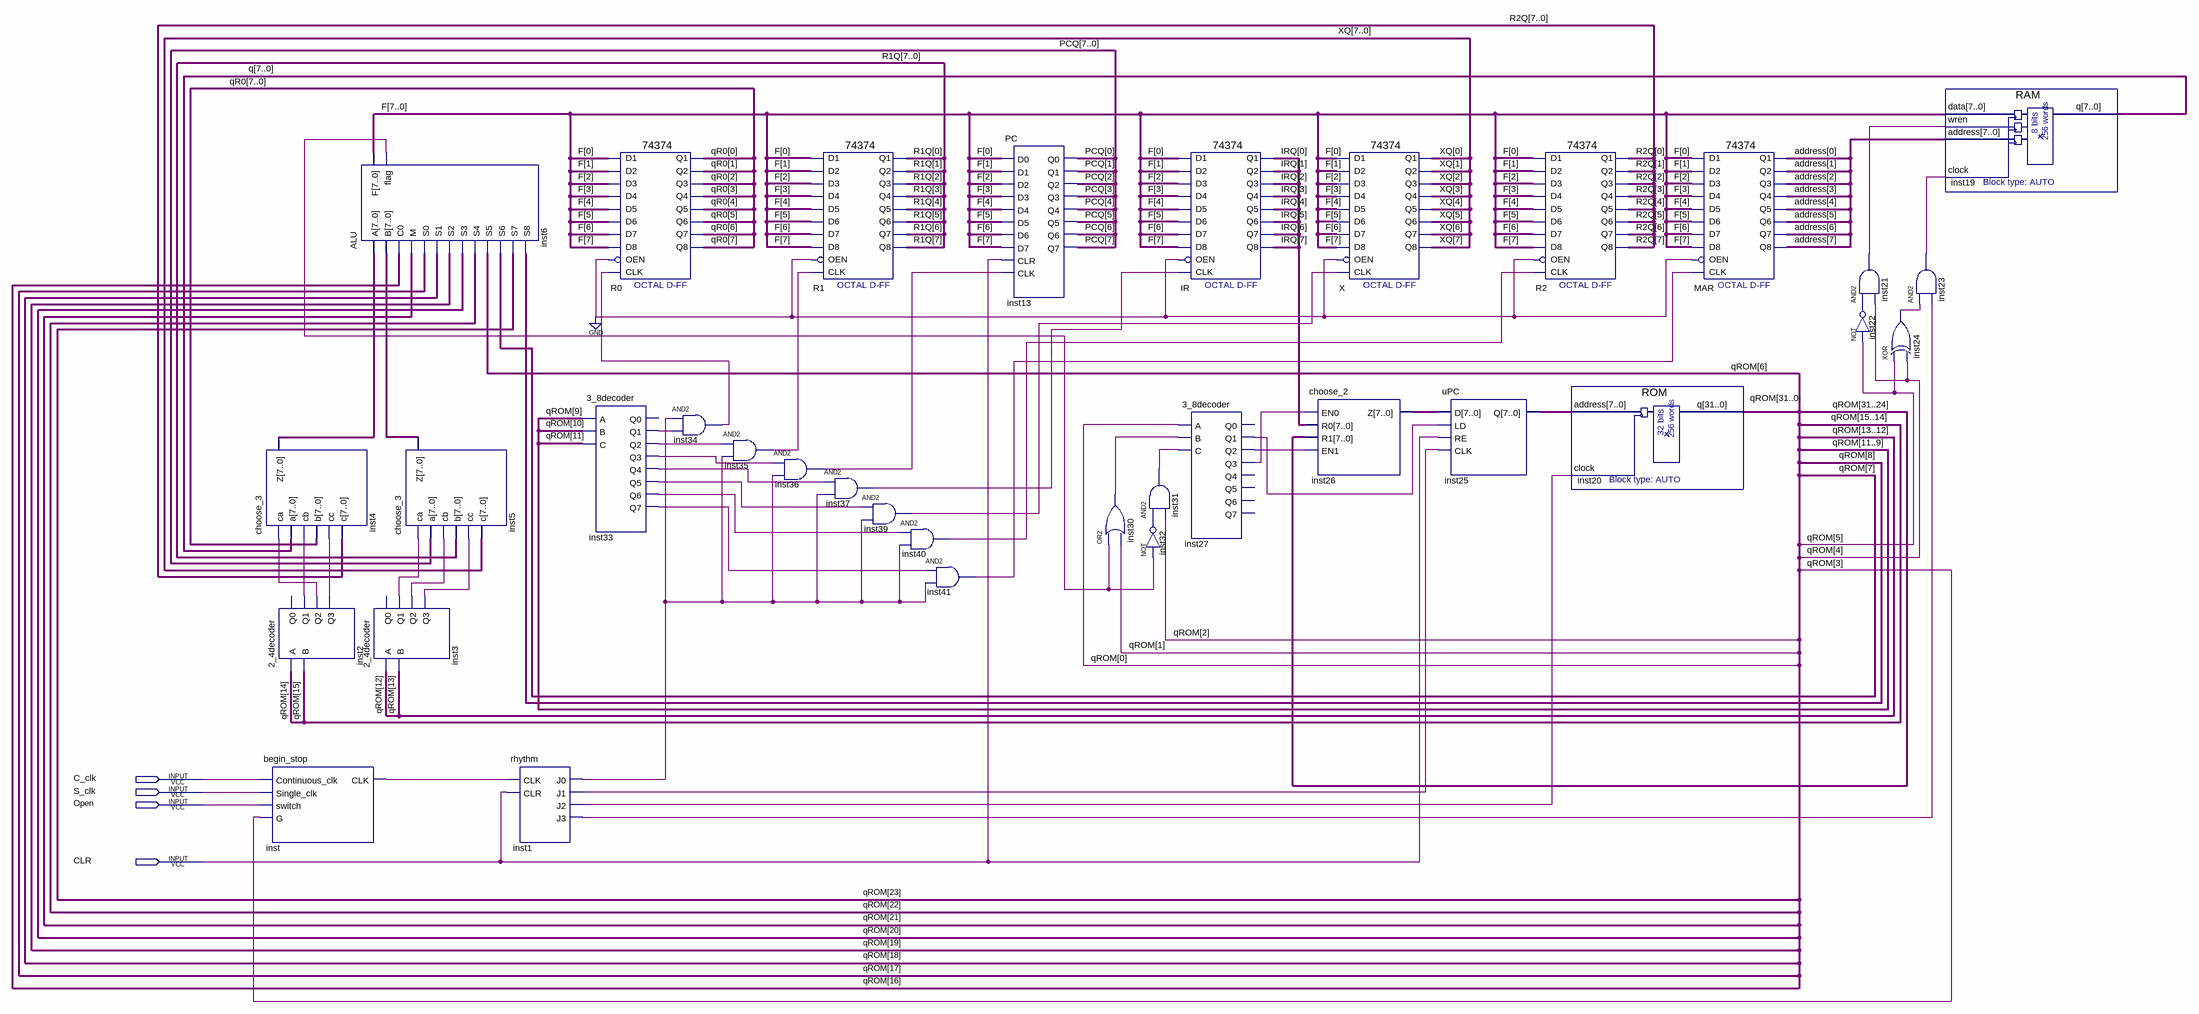
[diagram p0: schematic sheet]
// Quartus schematic ex3test.bdf as structural Verilog: 34 symbols, 4 pins
module ex3test (
  input  C_clk,
  input  S_clk,
  input  Open,
  input  CLR
);

  wire inst1_j0, inst1_j1, inst1_j2, inst1_j3, inst2_q1, inst2_q2, inst2_q3, inst3_q1, inst3_q2, inst3_q3,
       inst6_flag, inst21_out, inst22_out, inst23_out, inst24_out, inst27_q1, inst27_q2, inst27_q3,
       inst30_out, inst31_out, inst32_out, inst33_q1, inst33_q2, inst33_q3, inst33_q4, inst33_q5, inst33_q6,
       inst33_q7, inst34_out, inst35_out, inst36_out, inst37_out, inst39_out, inst40_out, inst41_out,
       inst_clk;
  wire [7:0] address, F, inst4_z, inst5_z, inst25_q, inst26_z, IRQ, PCQ, q, qR0, R1Q, R2Q, XQ;
  wire [31:0] qROM;

  choose_3 inst4 (.ca(inst2_q2), .a(q), .cb(inst2_q1), .b(qR0), .cc(inst2_q3), .c(R2Q), .Z(inst4_z));
  \2_4decoder  inst2 (.A(qROM[14]), .B(qROM[15]), .Q1(inst2_q1), .Q2(inst2_q2), .Q3(inst2_q3));  // open: Q0
  begin_stop inst (.Continuous_clk(C_clk), .Single_clk(S_clk), .switch(Open), .G(qROM[3]), .CLK(inst_clk));
  ALU inst6 (
    .A(inst4_z), .B(inst5_z), .C0(qROM[16]), .M(qROM[21]), .S0(qROM[17]), .S1(qROM[18]), .S2(qROM[19]),
    .S3(qROM[20]), .S4(qROM[22]), .S5(qROM[6]), .S6(qROM[7]), .S7(qROM[23]), .S8(qROM[8]), .F(F),
    .flag(inst6_flag));
  \2_4decoder  inst3 (.A(qROM[12]), .B(qROM[13]), .Q1(inst3_q1), .Q2(inst3_q2), .Q3(inst3_q3));  // open: Q0
  choose_3 inst5 (.ca(inst3_q1), .a(PCQ), .cb(inst3_q2), .b(R1Q), .cc(inst3_q3), .c(XQ), .Z(inst5_z));
  rhythm inst1 (.CLK(inst_clk), .CLR(CLR), .J0(inst1_j0), .J1(inst1_j1), .J2(inst1_j2), .J3(inst1_j3));
  \3_8decoder  inst33 (
    .A(qROM[9]), .B(qROM[10]), .C(qROM[11]), .Q1(inst33_q1), .Q2(inst33_q2), .Q3(inst33_q3), .Q4(inst33_q4),
    .Q5(inst33_q5), .Q6(inst33_q6), .Q7(inst33_q7));  // open: Q0
  \74374  R0 (
    .D1(F[0]), .D2(F[1]), .D3(F[2]), .D4(F[3]), .D6(F[5]), .D5(F[4]), .OEN(1'b0), .D8(F[7]), .D7(F[6]),
    .CLK(inst34_out), .Q2(qR0[1]), .Q3(qR0[2]), .Q5(qR0[4]), .Q4(qR0[3]), .Q6(qR0[5]), .Q7(qR0[6]),
    .Q8(qR0[7]), .Q1(qR0[0]));
  and inst34 (inst34_out, inst1_j0, inst33_q1);
  and inst35 (inst35_out, inst33_q2, inst1_j0);
  and inst36 (inst36_out, inst33_q3, inst1_j0);
  \74374  R1 (
    .D1(F[0]), .D2(F[1]), .D3(F[2]), .D4(F[3]), .D6(F[5]), .D5(F[4]), .OEN(1'b0), .D8(F[7]), .D7(F[6]),
    .CLK(inst35_out), .Q2(R1Q[1]), .Q3(R1Q[2]), .Q5(R1Q[4]), .Q4(R1Q[3]), .Q6(R1Q[5]), .Q7(R1Q[6]),
    .Q8(R1Q[7]), .Q1(R1Q[0]));
  and inst37 (inst37_out, inst33_q4, inst1_j0);
  and inst39 (inst39_out, inst33_q5, inst1_j0);
  and inst40 (inst40_out, inst33_q6, inst1_j0);
  and inst41 (inst41_out, inst33_q7, inst1_j0);
  PC inst13 (
    .D0(F[0]), .D1(F[1]), .D2(F[2]), .D3(F[3]), .D4(F[4]), .D5(F[5]), .D6(F[6]), .D7(F[7]), .CLR(CLR),
    .CLK(inst36_out), .Q0(PCQ[0]), .Q1(PCQ[1]), .Q2(PCQ[2]), .Q3(PCQ[3]), .Q4(PCQ[4]), .Q5(PCQ[5]),
    .Q6(PCQ[6]), .Q7(PCQ[7]));
  or inst30 (inst30_out, inst6_flag, qROM[1]);
  and inst31 (inst31_out, inst32_out, qROM[2]);
  not inst32 (inst32_out, inst6_flag);
  \74374  IR (
    .D1(F[0]), .D2(F[1]), .D3(F[2]), .D4(F[3]), .D6(F[5]), .D5(F[4]), .OEN(1'b0), .D8(F[7]), .D7(F[6]),
    .CLK(inst37_out), .Q2(IRQ[1]), .Q3(IRQ[2]), .Q5(IRQ[4]), .Q4(IRQ[3]), .Q6(IRQ[5]), .Q7(IRQ[6]),
    .Q8(IRQ[7]), .Q1(IRQ[0]));
  \3_8decoder  inst27 (
    .A(qROM[0]), .B(inst30_out), .C(inst31_out), .Q1(inst27_q1), .Q2(inst27_q2), .Q3(inst27_q3));  // open: Q0, Q4, Q5, Q6, Q7
  \74374  X (
    .D1(F[0]), .D2(F[1]), .D3(F[2]), .D4(F[3]), .D6(F[5]), .D5(F[4]), .OEN(1'b0), .D8(F[7]), .D7(F[6]),
    .CLK(inst39_out), .Q2(XQ[1]), .Q3(XQ[2]), .Q5(XQ[4]), .Q4(XQ[3]), .Q6(XQ[5]), .Q7(XQ[6]), .Q8(XQ[7]),
    .Q1(XQ[0]));
  choose_2 inst26 (.EN0(inst27_q3), .R0(IRQ), .R1(qROM[31:24]), .EN1(inst27_q2), .Z(inst26_z));
  uPC inst25 (.D(inst26_z), .LD(inst27_q1), .RE(CLR), .CLK(inst1_j1), .Q(inst25_q));
  \74374  R2 (
    .D1(F[0]), .D2(F[1]), .D3(F[2]), .D4(F[3]), .D6(F[5]), .D5(F[4]), .OEN(1'b0), .D8(F[7]), .D7(F[6]),
    .CLK(inst40_out), .Q2(R2Q[1]), .Q3(R2Q[2]), .Q5(R2Q[4]), .Q4(R2Q[3]), .Q6(R2Q[5]), .Q7(R2Q[6]),
    .Q8(R2Q[7]), .Q1(R2Q[0]));
  ROM inst20 (.address(inst25_q), .clock(inst1_j2), .q(qROM));
  \74374  MAR (
    .D1(F[0]), .D2(F[1]), .D3(F[2]), .D4(F[3]), .D6(F[5]), .D5(F[4]), .OEN(1'b0), .D8(F[7]), .D7(F[6]),
    .CLK(inst41_out), .Q2(address[1]), .Q3(address[2]), .Q5(address[4]), .Q4(address[3]), .Q6(address[5]),
    .Q7(address[6]), .Q8(address[7]), .Q1(address[0]));
  and inst21 (inst21_out, inst22_out, qROM[4]);
  not inst22 (inst22_out, qROM[5]);
  and inst23 (inst23_out, inst24_out, inst1_j3);
  xor inst24 (inst24_out, qROM[5], qROM[4]);
  RAM inst19 (.data(F), .wren(inst21_out), .address(address), .clock(inst23_out), .q(q));
endmodule
